# EAGLE board mosfet_out_cypress (EAGLE 7.2.0), part 1 of 2
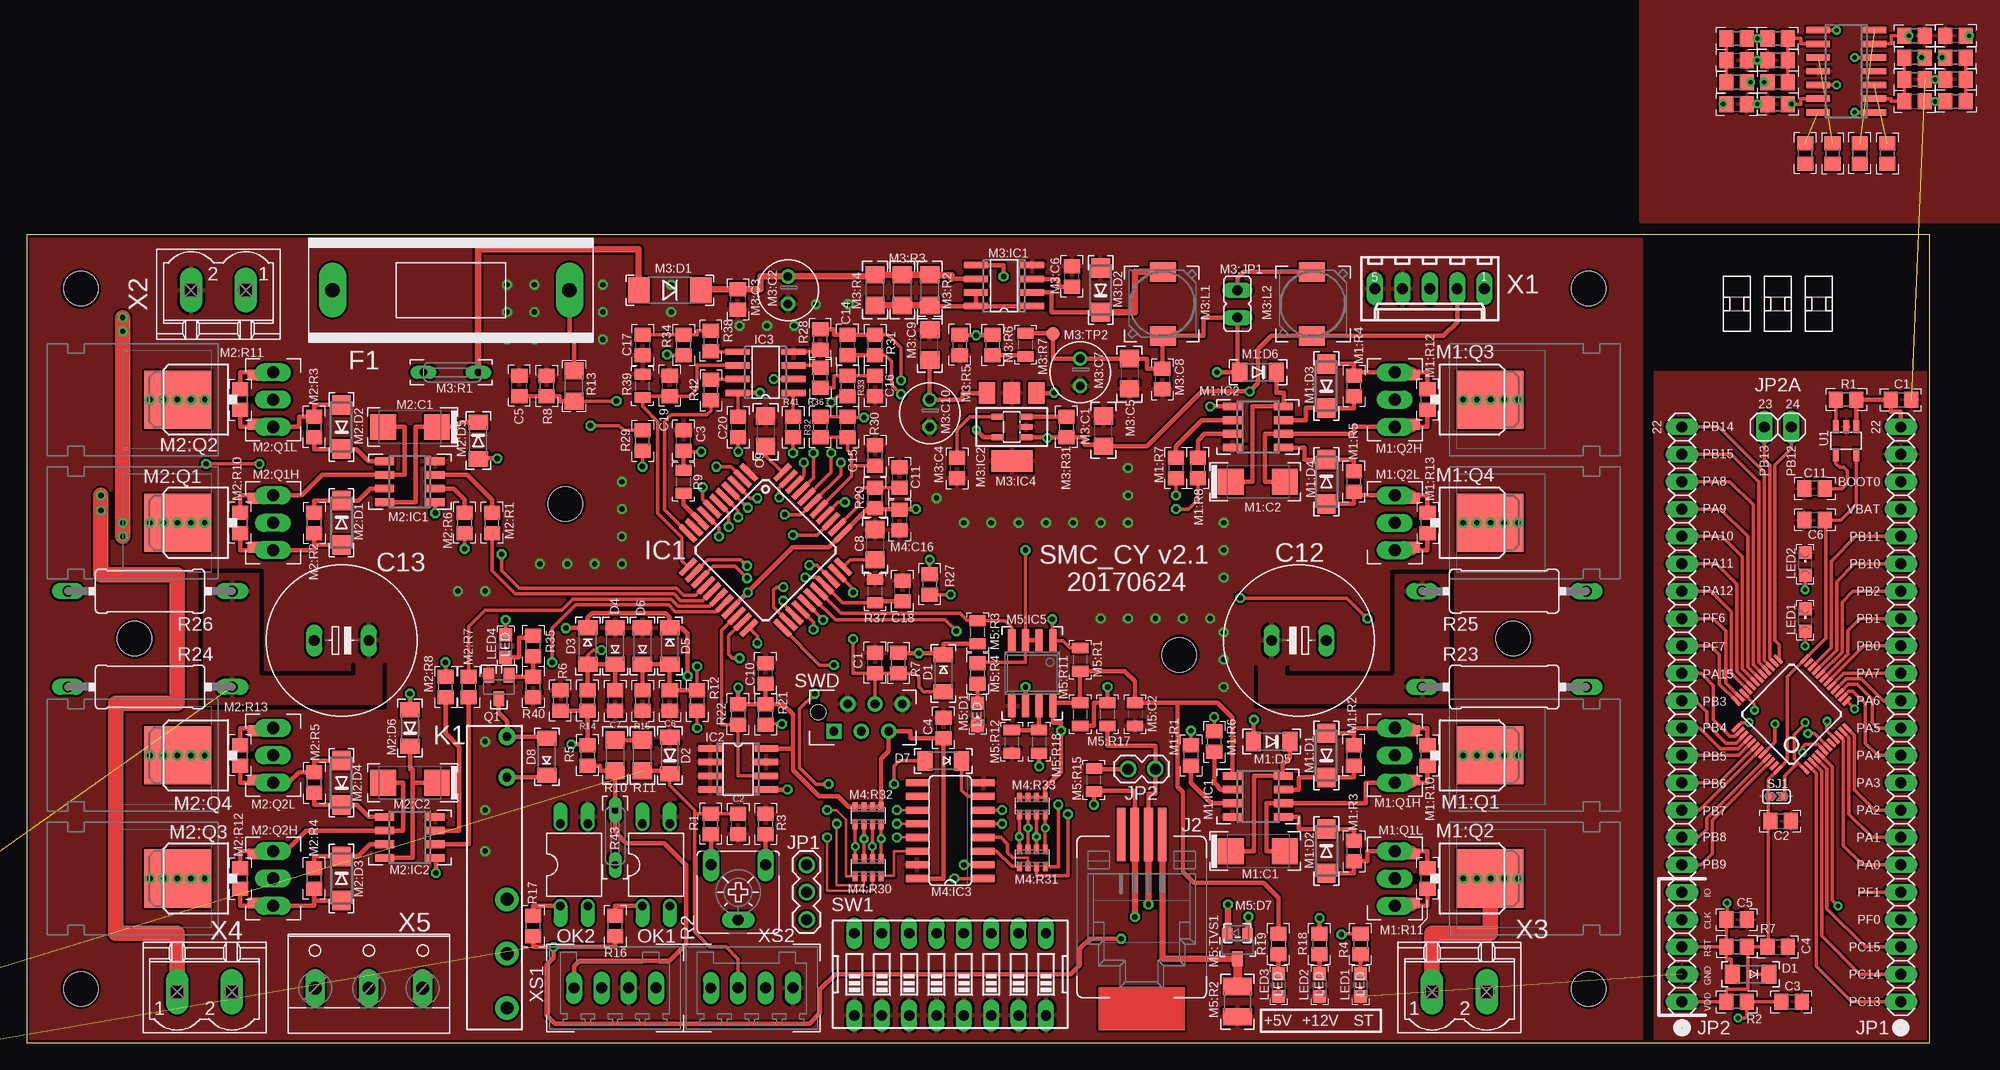
[diagram p7: board, top side]
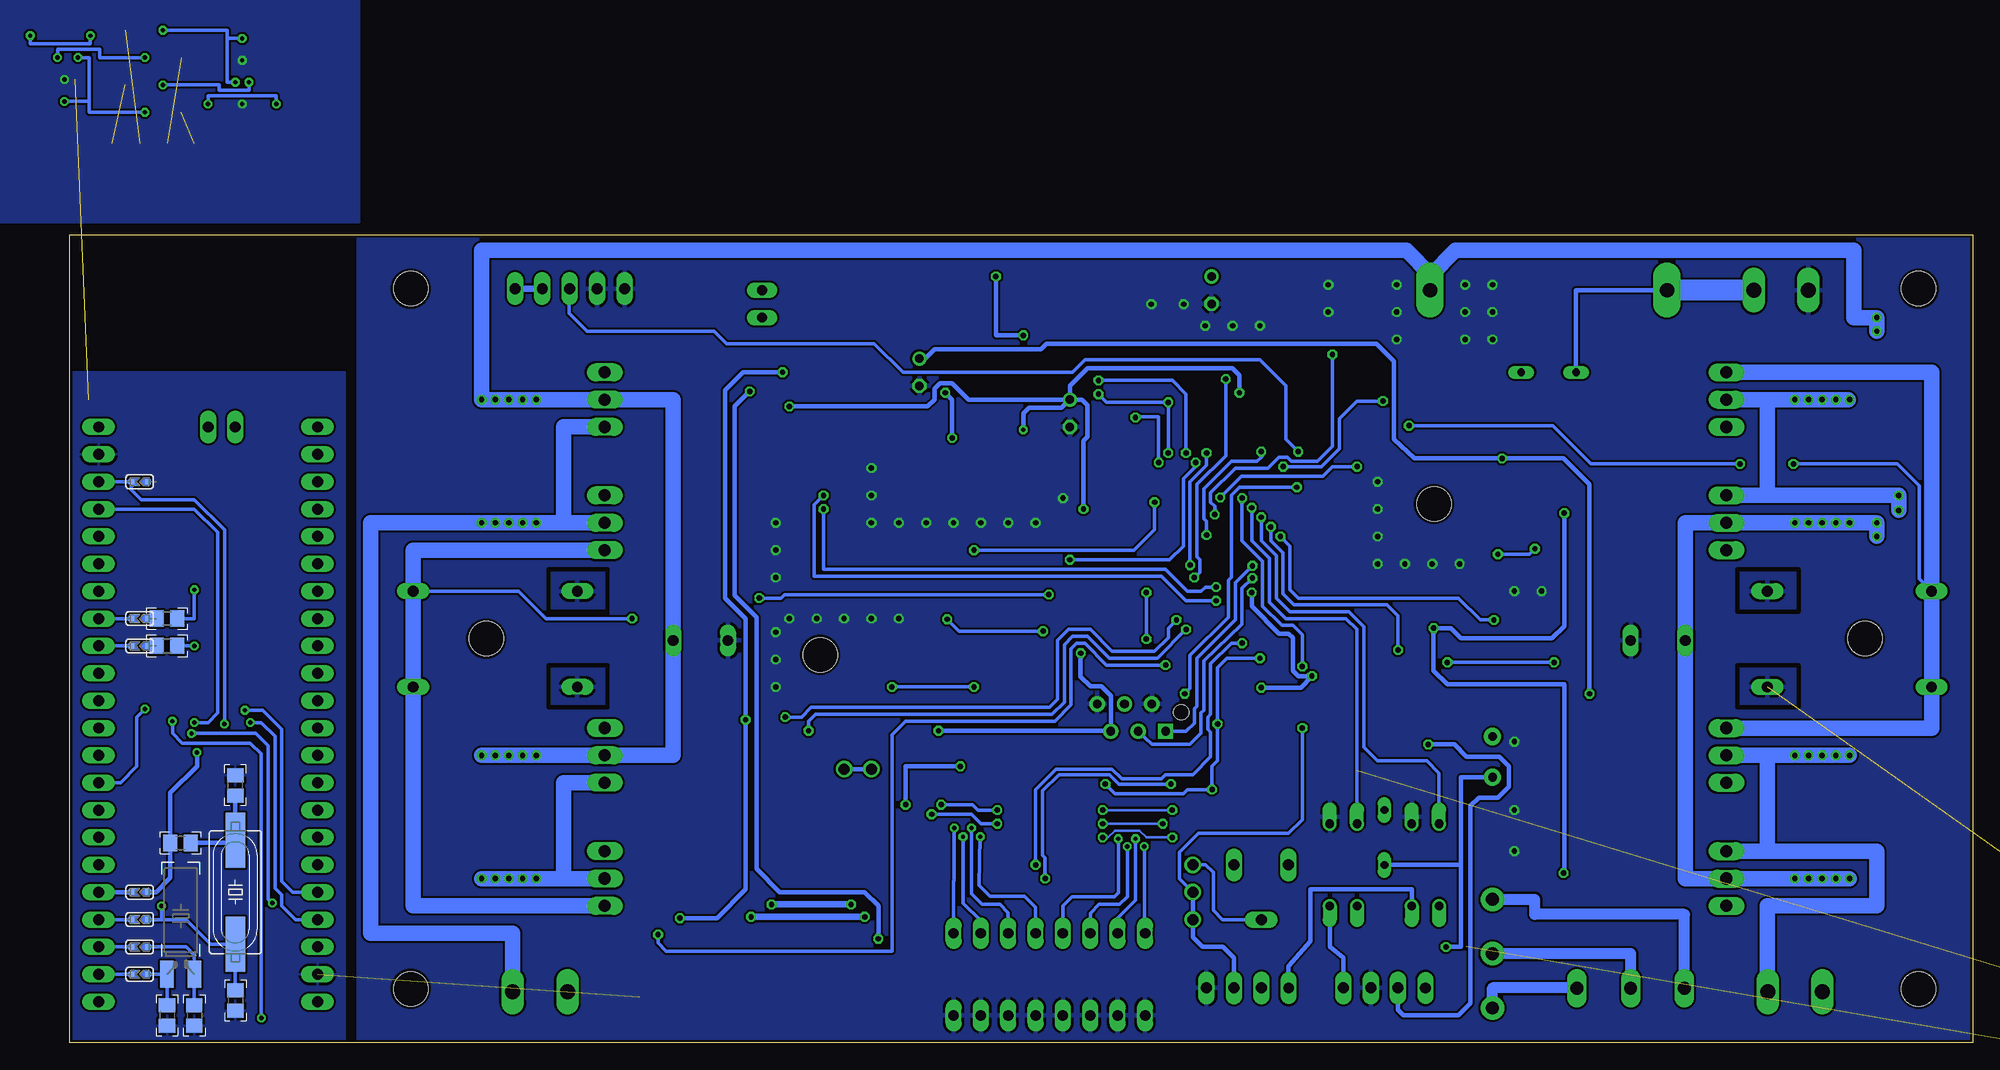
[diagram p8: board, bottom side, seen from below]

Size 176.67 x 75 mm. Coordinates in mm from the lower left corner, seen from the top.
Outline: 0,0 176.67,0 176.67,75 0,75 0,0
Copper layers (1*16): Top 0.035mm / dielectric 1.5mm / Bottom 0.035mm
Design rules "default *": minimum track width 0.006453125mm, minimum drill 0.4mm, track to track 0.1mm, track to pad 0.1mm, pad to pad 6mil, via to via 8mil, smd to smd 4mil, copper to edge 10mil, drill to drill 8mil, minimum pad ring 10mil, minimum via ring 8mil, stop-mask expansion 0.12mm, vias tented up to drill 0.5mm, thermal gap 10mil
Net classes: 0 default: clearance 0.2 mm; 1 power: clearance 0.305 mm to class 0, clearance 0.305 mm; 2 power+: clearance 0.42 mm to class 0
Holes 3.2 mm at 5,5 145,5 5,70 10,37.5 145,70 138,37.5 50,50 107,36
tRestrict: 14 lines
bRestrict: 16 lines

## Footprints (pad centres in the part's own frame; a part is rotated, then mirrored left to right if it is on the bottom)
C0805 = smd 1.3 x 1.5: 1 -0.95,0; 2 0.95,0
C1206 = smd 1.6 x 1.8: 1 -1.4,0; 2 1.4,0
E5-13 = drill 1 long: + -2.54,0; - 2.54,0
MINIMELF = smd 1.4 x 1.8: A 1.7,0; C -1.7,0
SH22 = drill 1.321 pad 2.54 long: 1 -10.998,0; 2 10.998,0
PQFP44 = smd 2 x 0.5: 1 -6.2,4; 2 -6.2,3.2; 3 -6.2,2.4; 4 -6.2,1.6; 5 -6.2,0.8; 6 -6.2,0; 7 -6.2,-0.8; 8 -6.2,-1.6; 9 -6.2,-2.4; 10 -6.2,-3.2; 11 -6.2,-4; 23 6.2,-4; 24 6.2,-3.2; 25 6.2,-2.4; 26 6.2,-1.6; 27 6.2,-0.8; 28 6.2,0; 29 6.2,0.8; 30 6.2,1.6; 31 6.2,2.4; 32 6.2,3.2; 33 6.2,4 | smd 0.5 x 2: 12 -4,-6.2; 13 -3.2,-6.2; 14 -2.4,-6.2; 15 -1.6,-6.2; 16 -0.8,-6.2; 17 0,-6.2; 18 0.8,-6.2; 19 1.6,-6.2; 20 2.4,-6.2; 21 3.2,-6.2; 22 4,-6.2; 34 4,6.2; 35 3.2,6.2; 36 2.4,6.2; 37 1.6,6.2; 38 0.8,6.2; 39 0,6.2; 40 -0.8,6.2; 41 -1.6,6.2; 42 -2.4,6.2; 43 -3.2,6.2; 44 -4,6.2
SO-08 = smd 0.6 x 2.2: 1 -1.905,-2.6; 2 -0.635,-2.6; 3 0.635,-2.6; 4 1.905,-2.6; 5 1.905,2.6; 6 0.635,2.6; 7 -0.635,2.6; 8 -1.905,2.6
SO08 = smd 0.6 x 2.2: 1 -1.905,-2.6; 2 -0.635,-2.6; 3 0.635,-2.6; 4 1.905,-2.6; 5 1.905,2.6; 6 0.635,2.6; 7 -0.635,2.6; 8 -1.905,2.6
RJ11_SMD = smd 0.8 x 5: 1 1.92,-9.17; 2 0.65,-9.17; 3 -0.62,-9.17; 4 -1.89,-9.17
1X03 = drill 1.016: 1 0,0; 2 2.54,0; 3 5.08,0
1X02 = drill 1.016: 1 0,0; 2 2.54,0
FTR-LYC = drill 0.8 pad 1.6: 1 -3.78,0; 2 0,0 | drill 1.2 pad 2.184: 3 11.34,0; 4 16.38,0; 5 21.42,0
CHIPLED_0805 = smd 1.2 x 1.2: A 0,-1.05; C 0,1.05
SMC_C = smd 2.4 x 2.4: + -2.5,0; - 2.5,0
DO214AC = smd 1.8 x 1.7: A 2.05,0; C -2.05,0
SO08' = smd 0.72 x 1.78: 1 -1.905,-2.35; 2 -0.635,-2.35; 3 0.635,-2.35; 4 1.905,-2.35; 5 1.905,2.35; 6 0.635,2.35; 7 -0.635,2.35; 8 -1.905,2.35
D-PAK_TO252AA = smd 1 x 1.6: 1 -2.28,-4.8; 3 2.28,-4.8 | smd 5.4 x 6.2: 4 0,2.5
TO220BH_NO_HOLE = drill 1.118 long: D 0,-6.35; G -2.54,-6.35; S 2.54,-6.35
R0805 = smd 1.3 x 1.5: 1 -0.95,0; 2 0.95,0
E2,5-6 = drill 0.8: + -1.27,0 | drill 0.8 octagon: - 1.27,0
MELF-MLL41 = smd 2 x 2.4: A 2.879,0; C -2.879,0
SOT223 = smd 1.5 x 2: 1 -2.3,-3.15; 2 0,-3.15; 3 2.3,-3.15 | smd 3.8 x 2: 4 0,3.15
SOT25 = smd 0.55 x 1.2: 1 -0.95,-1.3; 2 0,-1.3; 3 0.95,-1.3; 4 0.95,1.3; 5 -0.95,1.3
JP1 = drill 0.914 long: 1 0,-1.27; 2 0,1.27
DR7045 = smd 2.4 x 1.8: 1 -0.063,2.967; 2 -0.064,-2.967
B57164 = drill 0.7 long: 1 -2.54,0; 2 2.54,0
R1206 = smd 1.6 x 1.803: 1 -1.422,0; 2 1.422,0
R0805' = smd 1 x 1.5: 1 -1.077,0; 2 1.077,0
B1,27 = smd 1.27 x 1.27: PP 0,0
SO16 = smd 0.66 x 2.032: 1 -4.445,-3.073; 2 -3.175,-3.073; 3 -1.905,-3.073; 4 -0.635,-3.073; 5 0.635,-3.073; 6 1.905,-3.073; 7 3.175,-3.073; 8 4.445,-3.073; 9 4.445,3.073; 10 3.175,3.073; 11 1.905,3.073; 12 0.635,3.073; 13 -0.635,3.073; 14 -1.905,3.073; 15 -3.175,3.073; 16 -4.445,3.073
CTS742C083 = smd 0.46 x 0.9: 1A -1.2,-0.8; 1B -1.2,0.8; 2A -0.4,-0.8; 2B -0.4,0.8; 3A 0.4,-0.8; 3B 0.4,0.8; 4A 1.2,-0.8; 4B 1.2,0.8
C0805' = smd 1 x 1.5: 1 -1.077,0; 2 1.077,0
SOD323-R = smd 0.6 x 0.6: A 1.1,0; C -1.1,0
ESOP-8 = smd 0.66 x 2.032: 1 -1.905,-3.073; 2 -0.635,-3.073; 3 0.635,-3.073; 4 1.905,-3.073; 5 1.905,3.073; 6 0.635,3.073; 7 -0.635,3.073; 8 -1.905,3.073
R1210 = smd 1.6 x 2.7: 1 -1.4,0; 2 1.4,0
SOT23 = smd 1 x 1.4: 1 -0.95,-1.1; 2 0.95,-1.1; 3 0,1.1
DIL04 = drill 0.8 pad 1.27 offset: 1 -1.27,-3.81; 2 1.27,-3.81; 3 1.27,3.81; 4 -1.27,3.81
SOT23-BEC = smd 1 x 1.4: B -0.95,-1.1; C 0,1.1; E 0.95,-1.1
CA6V = drill 1.016 long: A -2.54,-2.54; E 2.54,-2.54; S 0,2.54
0411/15 = drill 1 long: 1 -7.62,0; 2 7.62,0
0207/7 = drill 0.8 octagon: 1 -3.81,0; 2 3.81,0
TQFP48 = smd 0.32 x 1: 1 -2.75,-4.5; 2 -2.25,-4.5; 3 -1.75,-4.5; 4 -1.25,-4.5; 5 -0.75,-4.5; 6 -0.25,-4.5; 7 0.25,-4.5; 8 0.75,-4.5; 9 1.25,-4.5; 10 1.75,-4.5; 11 2.25,-4.5; 12 2.75,-4.5; 25 2.75,4.5; 26 2.25,4.5; 27 1.75,4.5; 28 1.25,4.5; 29 0.75,4.5; 30 0.25,4.5; 31 -0.25,4.5; 32 -0.75,4.5; 33 -1.25,4.5; 34 -1.75,4.5; 35 -2.25,4.5; 36 -2.75,4.5 | smd 1 x 0.32: 13 4.5,-2.75; 14 4.5,-2.25; 15 4.5,-1.75; 16 4.5,-1.25; 17 4.5,-0.75; 18 4.5,-0.25; 19 4.5,0.25; 20 4.5,0.75; 21 4.5,1.25; 22 4.5,1.75; 23 4.5,2.25; 24 4.5,2.75; 37 -4.5,2.75; 38 -4.5,2.25; 39 -4.5,1.75; 40 -4.5,1.25; 41 -4.5,0.75; 42 -4.5,0.25; 43 -4.5,-0.25; 44 -4.5,-0.75; 45 -4.5,-1.25; 46 -4.5,-1.75; 47 -4.5,-2.25; 48 -4.5,-2.75
SO14 = smd 0.6 x 2.2: 1 -3.81,-2.6; 2 -2.54,-2.6; 3 -1.27,-2.6; 4 0,-2.6; 5 1.27,-2.6; 6 2.54,-2.6; 7 3.81,-2.6; 8 3.81,2.6; 9 2.54,2.6; 10 1.27,2.6; 11 0,2.6; 12 -1.27,2.6; 13 -2.54,2.6; 14 -3.81,2.6
1X22 = drill 1.016 long: 1 -26.67,0; 2 -24.13,0; 3 -21.59,0; 4 -19.05,0; 5 -16.51,0; 6 -13.97,0; 7 -11.43,0; 8 -8.89,0; 9 -6.35,0; 10 -3.81,0; 11 -1.27,0; 12 1.27,0; 13 3.81,0; 14 6.35,0; 15 8.89,0; 16 11.43,0; 17 13.97,0; 18 16.51,0; 19 19.05,0; 20 21.59,0; 21 24.13,0; 22 26.67,0
1X02' = drill 1.016 long: 1 -1.27,0; 2 1.27,0
TC38H = smd 1.27 x 2.54: 1 -1.27,0; 2 1.27,0
SM49 = smd 5.08 x 1.778: 1 -4.826,0; 2 4.826,0
SJA = smd 0.5 x 0.5: 1 -0.762,0; 2 0.762,0
DIPSWITCH-08 = drill 0.97 long: 1 -8.89,-3.81; 2 -6.35,-3.81; 3 -3.81,-3.81; 4 -1.27,-3.81; 5 1.27,-3.81; 6 3.81,-3.81; 7 6.35,-3.81; 8 8.89,-3.81; 9 8.89,3.81; 10 6.35,3.81; 11 3.81,3.81; 12 1.27,3.81; 13 -1.27,3.81; 14 -3.81,3.81; 15 -6.35,3.81; 16 -8.89,3.81
ISP = drill 0.8 pad 1.422 square: 1 -2.54,-1.27 | drill 0.8 pad 1.422: 2 -1.27,1.27; 3 0,-1.27; 4 1.27,1.27; 5 2.54,-1.27; 6 3.81,1.27 | hole 1.4: -4,0.5
6410-05 = drill 1.016 long: 1 -5.08,0; 2 -2.54,0; 3 0,0; 4 2.54,0; 5 5.08,0
MSTBV2 = drill 1.397 long: 1 -2.54,0; 2 2.54,0
W237-103 = drill 1.194 long: 1 -5,-1.29; 2 0,-1.29; 3 5,-1.29
ZALIA_4K = drill 1 long: 1 -3.81,0 | drill 1.016 long: 2 -1.27,0; 3 1.27,0; 4 3.81,0

## Placement (x,y rotation side)
C1  10nF  [C0805]  78.74,35.26 90 top
C2  0.1uF  [C0805]  66.04,20.32 270 top
C3  0.1uF  [C0805]  60.96,55.88 90 top
C4  0.1uF  [C0805]  85.09,29.21 90 top
C5  0.1uF  [C0805]  45.72,60.96 90 top
C6  0.1uF  [C0805]  59.69,31.75 270 top
C7  0.1uF  [C0805]  54.61,31.75 270 top
C8  1.0uF  [C1206]  78.74,46.23 270 top
C9  1.0uF  [C1206]  68.58,56.77 270 top
C10  0.1uF  [C0805]  68.58,34.29 90 top
C11  0.1uF  [C0805]  81.03,52.45 270 top
C12  1000uF/50V  [E5-13]  118.11,37.34 180 top
C13  1000uF/50V  [E5-13]  29.21,37.34 0 top
C14  100pF  [C0805]  76.2,64.77 90 top
C15  100pF  [C0805]  76.2,57.15 270 top
C16  100pF  [C0805]  78.74,60.96 270 top
C17  100pF  [C0805]  57.15,64.77 270 top
C18  100pF  [C0805]  81.28,41.91 90 top
C19  100pF  [C0805]  59.69,60.96 90 top
C20  0.1uF  [C0805]  66.04,57.15 270 top
D1  BAS85  [MINIMELF]  85.09,34.29 270 top
D2  12V  [MINIMELF]  59.69,26.67 90 top
D3  BAS32  [MINIMELF]  52.07,36.83 270 top
D4  BAS32  [MINIMELF]  54.61,36.83 90 top
D5  BAS32  [MINIMELF]  59.69,36.83 270 top
D6  BAS32  [MINIMELF]  57.15,36.83 90 top
D7  BAS85  [MINIMELF]  85.09,26.16 180 top
D8  BAS32  [MINIMELF]  48.26,26.54 90 top
F1  8A  [SH22]  39.37,69.85 0 top
IC1  CY8C4245AXI  [PQFP44]  68.58,45.72 315 top
IC2  24AA02SN  [SO-08]  66.04,25.4 270 top
IC3  LM393D  [SO08]  68.58,62.23 90 top
J1  [JUMP]  158.75,68.58 180 top
J2  RS485  [RJ11_SMD]  103.5,10.16 180 top
J3  [JUMP]  166.37,68.58 0 top
JP1  [1X03]  72.39,16.51 270 top
JP2  TERM  [1X02]  104.78,25.4 180 top
K1  FAULT  [FTR-LYC]  44.58,24.64 270 top
LED1  EL19-21SYGC  [CHIPLED_0805]  123.83,5.33 180 top
LED2  EL19-21SYGC  [CHIPLED_0805]  120.02,5.33 180 top
LED3  EL19-21SYGC  [CHIPLED_0805]  116.2,5.33 180 top
LED4  EL19-21SYGC  [CHIPLED_0805]  44.45,36.83 180 top
M1:C1  22uF  [SMC_C]  114.3,17.78 0 top
M1:C2  22uF  [SMC_C]  114.3,52.07 0 top
M1:D1  10MQ100N  [DO214AC]  120.65,26.67 90 top
M1:D2  10MQ100N  [DO214AC]  120.65,17.78 270 top
M1:D3  10MQ100N  [DO214AC]  120.65,60.96 90 top
M1:D4  10MQ100N  [DO214AC]  120.65,52.07 270 top
M1:D5  BAS32  [MINIMELF]  115.57,27.94 180 top
M1:D6  BAS32  [MINIMELF]  114.3,62.23 180 top
M1:IC1  IR2101S  [SO08']  114.3,22.86 270 top
M1:IC2  IR2101S  [SO08']  114.3,57.15 270 top
M1:Q1  IRFP3607  [D-PAK_TO252AA]  133.35,26.67 270 top
M1:Q1H  IRF540  [TO220BH_NO_HOLE]  133.35,26.67 270 top
M1:Q1L  IRF540  [TO220BH_NO_HOLE]  133.35,15.24 270 top
M1:Q2  IRFP3607  [D-PAK_TO252AA]  133.35,15.24 270 top
M1:Q2H  IRF540  [TO220BH_NO_HOLE]  133.35,59.69 270 top
M1:Q2L  IRF540  [TO220BH_NO_HOLE]  133.35,48.26 270 top
M1:Q3  IRFP3607  [D-PAK_TO252AA]  133.35,59.69 270 top
M1:Q4  IRFP3607  [D-PAK_TO252AA]  133.35,48.26 270 top
M1:R1  120R  [R0805]  108.08,26.67 270 top
M1:R2  30R  [R0805]  123.19,26.67 90 top
M1:R3  30R  [R0805]  123.19,17.78 270 top
M1:R4  30R  [R0805]  123.19,60.96 270 top
M1:R5  30R  [R0805]  123.19,52.07 90 top
M1:R6  120R  [R0805]  110.24,27.94 270 top
M1:R7  120R  [R0805]  106.68,53.34 90 top
M1:R8  120R  [R0805]  108.71,53.34 90 top
M1:R10  1k  [R0805]  130.05,26.67 270 top
M1:R11  1k  [R0805]  130.05,15.24 90 top
M1:R12  1k  [R0805]  130.05,59.69 90 top
M1:R13  1k  [R0805]  130.05,48.26 270 top
M2:C1  22uF  [SMC_C]  35.56,57.15 180 top
M2:C2  22uF  [SMC_C]  35.56,24.13 180 top
M2:D1  10MQ100N  [DO214AC]  29.21,48.26 270 top
M2:D2  10MQ100N  [DO214AC]  29.21,57.15 90 top
M2:D3  10MQ100N  [DO214AC]  29.21,15.24 270 top
M2:D4  10MQ100N  [DO214AC]  29.21,24.13 90 top
M2:D5  BAS32  [MINIMELF]  41.91,55.88 270 top
M2:D6  BAS32  [MINIMELF]  35.56,29.21 90 top
M2:IC1  IR2101S  [SO08']  35.56,52.07 90 top
M2:IC2  IR2101S  [SO08']  35.56,19.05 90 top
M2:Q1  IRFP3607  [D-PAK_TO252AA]  16.51,48.26 90 top
M2:Q1H  IRF540  [TO220BH_NO_HOLE]  16.51,48.26 90 top
M2:Q1L  IRF540  [TO220BH_NO_HOLE]  16.51,59.69 90 top
M2:Q2  IRFP3607  [D-PAK_TO252AA]  16.51,59.69 90 top
M2:Q2H  IRF540  [TO220BH_NO_HOLE]  16.51,15.24 90 top
M2:Q2L  IRF540  [TO220BH_NO_HOLE]  16.51,26.67 90 top
M2:Q3  IRFP3607  [D-PAK_TO252AA]  16.51,15.24 90 top
M2:Q4  IRFP3607  [D-PAK_TO252AA]  16.51,26.67 90 top
M2:R1  120R  [R0805]  43.18,48.26 90 top
M2:R2  30R  [R0805]  26.67,48.26 270 top
M2:R3  30R  [R0805]  26.67,57.15 90 top
M2:R4  30R  [R0805]  26.67,15.24 90 top
M2:R5  30R  [R0805]  26.67,24.13 270 top
M2:R6  120R  [R0805]  40.64,48.26 90 top
M2:R7  120R  [R0805]  41.02,33.02 270 top
M2:R8  120R  [R0805]  38.86,33.02 270 top
M2:R10  1k  [R0805]  19.81,48.26 90 top
M2:R11  1k  [R0805]  19.81,59.69 270 top
M2:R12  1k  [R0805]  19.81,15.24 270 top
M2:R13  1k  [R0805]  19.81,26.67 90 top
M3:C1  1.0uF  [C1206]  99.95,56.77 90 top
M3:C2  47uF/35V  [E2,5-6]  70.66,69.85 270 top
M3:C3  0.1uF  [C0805]  66,69 270 top
M3:C4  10nF  [C0805]  86.36,53.34 270 top
M3:C5  1.0uF  [C1206]  102.36,62.1 270 top
M3:C6  470pF  [C0805]  97.03,71.12 90 top
M3:C7  100uF/16V  [E2,5-6]  97.79,62.23 270 top
M3:C8  0.1uF  [C0805]  105.41,61.59 270 top
M3:C9  1.0uF  [C1206]  83.82,64.77 90 top
M3:C10  100uF/16V  [E2,5-6]  83.82,58.42 270 top
M3:D1  LL4004G  [MELF-MLL41]  59.69,69.85 180 top
M3:D2  10MQ100N  [DO214AC]  99.69,69.85 90 top
M3:IC1  MC34063AD  [SO08]  90.72,70.27 90 top
M3:IC2  LM340MP-5.0  [SOT223]  91.44,57.15 180 top
M3:IC4  SIP21106  [SOT25]  91.44,57.15 90 top
M3:J1  VB power  [JUMP]  162.56,68.58 180 top
M3:JP1  [JP1]  112.39,68.58 180 top
M3:L1  330uH  [DR7045]  105.41,68.58 180 top
M3:L2  330uH  [DR7045]  119.38,68.58 0 top
M3:R1  72V 400mA  [B57164]  39.37,62.23 0 top
M3:R2  1.0R  [R1206]  83.82,69.85 270 top
M3:R3  1.0R  [R1206]  81.28,69.85 270 top
M3:R4  1.0R  [R1206]  78.74,69.85 270 top
M3:R5  4.7k  [R0805]  86.61,64.77 90 top
M3:R6  12k  [R0805]  89.66,64.77 270 top
M3:R7  xxx  [R0805']  92.71,64.77 90 top
M3:R31  1k  [R0805]  96.52,57.15 90 top
M3:TP2  TPB1,27  [B1,27]  95.25,65.79 180 top
M4:C16  0.1uF  [C0805]  81.03,48.51 270 top
M4:IC3  74AC165D  [SO16]  85.72,19.68 90 top
M4:R30  120R  [CTS742C083]  78.11,16.26 0 top
M4:R31  120R  [CTS742C083]  93.34,17.14 0 top
M4:R32  1k  [CTS742C083]  78.11,21.08 0 top
M4:R33  1k  [CTS742C083]  93.34,21.97 0 top
M5:C2  0.1  [C0805']  102.87,30.48 270 top
M5:D1  EL19-21SYGC  [CHIPLED_0805]  88.27,30.48 180 top
M5:D7  PESD1LIN  [SOD323-R]  112.39,10.16 0 top
M5:IC5  MAX485  [ESOP-8]  93.34,34.29 180 top
M5:R1  4.7k  [R0805']  97.79,35.56 90 top
M5:R2  100R  [R1210]  112.39,3.81 90 top
M5:R3  4.7k  [R0805']  88.27,38.1 90 top
M5:R4  1k  [R0805]  88.27,34.29 270 top
M5:R11  4.7k  [R0805']  97.79,30.48 270 top
M5:R12  4.7k  [R0805']  91.44,27.94 90 top
M5:R15  120  [R0805']  99.06,24.38 90 top
M5:R17  47R  [R0805']  100.33,30.48 270 top
M5:R18  47R  [R0805']  93.98,27.94 270 top
M5:TVS1  SM712  [SOT23]  112.39,8.89 180 top
OK1  PC817  [DIL04]  58.42,16.51 0 top
OK2  PC817  [DIL04]  50.8,16.51 0 top
Q1  BC817  [SOT23-BEC]  43.81,33.02 180 top
R1  120R  [R0805]  63.5,20.32 90 top
R2  10k  [CA6V]  66.04,13.97 180 top
R3  120R  [R0805]  68.58,20.32 270 top
R4  120R  [R0805]  123.83,9.14 90 top
R5  4.7k  [R0805]  52.07,26.67 90 top
R6  4.7k  [R0805]  49.53,31.75 90 top
R7  15k  [R0805]  80.9,35.26 270 top
R8  22k  [R1206]  50.8,60.96 90 top
R9  10k  [R0805']  60.96,52.07 270 top
R10  120R  [R1206]  54.61,26.67 270 top
R11  120R  [R1206]  57.15,26.67 90 top
R12  10k  [R0805]  62.23,31.75 270 top
R13  2k  [R0805]  48.26,60.96 270 top
R14  10k  [R0805]  52.07,31.75 90 top
R15  10k  [R0805]  57.15,31.75 270 top
R16  1k  [R0805]  54.61,10.83 270 top
R17  1k  [R0805]  46.99,10.83 270 top
R18  1k  [R0805]  120.02,9.14 90 top
R19  120R  [R0805]  116.2,9.14 90 top
R20  120R  [R0805]  78.74,50.55 90 top
R21  4.7k  [R0805]  68.58,30.48 270 top
R22  4.7k  [R0805]  66.04,30.48 90 top
R23  0.1  [0411/15]  137.16,33.02 0 top
R24  0.1  [0411/15]  11.43,33.02 180 top
R25  0.1  [0411/15]  137.16,41.91 0 top
R26  0.1  [0411/15]  11.43,41.91 180 top
R27  2k  [R0805]  83.82,42.55 90 top
R28  2k  [R0805]  73.66,65.28 90 top
R29  2k  [R0805]  57.15,55.88 270 top
R30  2k  [R0805]  78.74,54.48 270 top
R31  10k  [R0805]  78.74,64.77 270 top
R32  10k  [R0805]  73.66,57.15 90 top
R33  1k  [R0805]  76.2,60.96 270 top
R34  1k  [R0805]  60.96,64.77 270 top
R35  4.7k  [R0805]  46.99,36.83 270 top
R36  1k  [R0805]  73.66,61.72 270 top
R37  1.8k  [R0805']  78.74,41.91 90 top
R38  1k  [R0805]  63.5,65.15 90 top
R39  1.8k  [R0805']  57.15,60.96 90 top
R40  10k  [R0805]  46.99,33.02 270 top
R41  22R  [R0805]  71.12,57.15 270 top
R42  22R  [R0805]  63.5,60.58 270 top
R43  60V 50mA  [B57164]  54.61,19.05 90 top
R44  24R  [0207/7]  -20,-2 0 top  (outside the outline)
R46  9.1k  [R0805]  -23,2 270 top  (outside the outline)
R47  3k  [R0805]  -23,6 270 top  (outside the outline)
STM:C1  0.1uF  [C0805]  173.99,59.69 0 top
STM:C2  0.1uF  [C0805]  162.81,20.57 0 top
STM:C3  0.1uF  [C0805]  163.83,3.81 0 top
STM:C4  0.1uF  [C0805]  162.56,8.89 0 top
STM:C5  10nF  [C0805]  158.75,11.43 0 top
STM:C6  0.1uF  [C0805]  165.99,48.51 180 top
STM:C7  33pF  [C0805]  167.64,2.54 270 bottom
STM:C8  33pF  [C0805]  165.1,2.54 270 bottom
STM:C9  33pF  [C0805]  161.29,3.94 270 bottom
STM:C10  33pF  [C0805]  161.29,23.88 90 bottom
STM:C11  10nF  [C0805]  165.99,51.44 180 top
STM:C12  100pF  [C0805]  175.26,87.38 0 top  (outside the outline)
STM:C13  100pF  [C0805]  179.07,89.41 180 top  (outside the outline)
STM:C14  100pF  [C0805]  179.07,93.47 180 top  (outside the outline)
STM:C15  100pF  [C0805]  158.75,91.19 0 top  (outside the outline)
STM:C16  100pF  [C0805]  158.75,87.12 0 top  (outside the outline)
STM:C17  100pF  [C0805]  162.56,89.15 180 top  (outside the outline)
STM:D1  BAS85  [MINIMELF]  160.02,6.35 180 top
STM:IC1  STM32F051C6T  [TQFP48]  163.83,30.48 45 top
STM:IC2  LM2902D  [SO14]  168.91,90.17 90 top  (outside the outline)
STM:JP1  [1X22]  173.99,30.48 90 top
STM:JP2  [1X22]  153.67,30.48 90 top
STM:JP2A  [1X02']  162.56,57.15 0 top
STM:LED1  EL19-21SYGC  [CHIPLED_0805]  165.1,39.24 0 top
STM:LED2  EL19-21SYGC  [CHIPLED_0805]  165.1,44.45 0 top
STM:Q1  32k  [TC38H]  166.37,6.35 0 bottom
STM:Q2  [SM49]  161.29,13.97 90 bottom
STM:R1  10k  [R0805]  168.91,59.69 180 top
STM:R2  120R  [R0805]  158.75,3.81 0 top
STM:R3  1k  [R0805]  167.64,36.83 0 bottom
STM:R4  1k  [R0805]  167.64,39.37 0 bottom
STM:R5  330R  [R0805]  166.37,18.54 0 bottom
STM:R6  2k  [R0805]  172.72,82.55 270 top  (outside the outline)
STM:R7  15k  [R0805]  158.75,8.89 180 top
STM:R8  2k  [R0805]  175.26,89.41 0 top  (outside the outline)
STM:R9  10k  [R0805]  175.26,91.44 180 top  (outside the outline)
STM:R10  1k  [R0805]  179.07,87.38 180 top  (outside the outline)
STM:R11  1k  [R0805]  179.07,91.44 0 top  (outside the outline)
STM:R12  1k  [R0805]  175.26,93.47 0 top  (outside the outline)
STM:R13  2k  [R0805]  167.64,82.55 270 top  (outside the outline)
STM:R14  2k  [R0805]  162.56,91.19 180 top  (outside the outline)
STM:R15  1k  [R0805]  158.75,93.22 0 top  (outside the outline)
STM:R16  1k  [R0805]  158.75,89.15 180 top  (outside the outline)
STM:R17  1k  [R0805]  162.56,87.12 180 top  (outside the outline)
STM:R18  1k  [R0805]  165.1,82.55 90 top  (outside the outline)
STM:R19  1k  [R0805]  170.18,82.55 90 top  (outside the outline)
STM:R20  10k  [R0805]  162.56,93.22 0 top  (outside the outline)
STM:SJ1  [SJA]  162.43,22.86 0 top
STM:SJ2  [SJA]  170.18,52.07 180 bottom
STM:SJ3  [SJA]  170.18,6.35 180 bottom
STM:SJ4  [SJA]  170.18,8.89 180 bottom
STM:SJ5  [SJA]  170.18,11.43 180 bottom
STM:SJ6  [SJA]  170.18,13.97 180 bottom
STM:SJ7  [SJA]  170.18,36.83 180 bottom
STM:SJ8  [SJA]  170.18,39.37 180 bottom
STM:U1  SIP21106-DT-33-E3  [SOT25]  168.91,55.88 180 top
SW1  [DIPSWITCH-08]  85.72,6.35 0 top
SWD  SWD  [ISP]  77.47,30.18 0 top
VR1  TL431D  [SO-08]  -19,4 0 top  (outside the outline)
X1  [6410-05]  130.25,70 180 top
X2  Power  [MSTBV2]  17.78,69.85 180 top
X3  WIND A  [MSTBV2]  133,4.73 0 top
X4  WIND B  [MSTBV2]  16.49,4.73 0 top
X5  FAULT  [W237-103]  31.75,6.35 0 top
XS1  [ZALIA_4K]  54.61,5.08 0 top
XS2  [ZALIA_4K]  67.31,5.08 0 top